# Altium schematic sheet TOP_LEVEL.SchDoc
size A4; DocumentNumber: 2; SheetNumber: 2; SheetTotal: 9
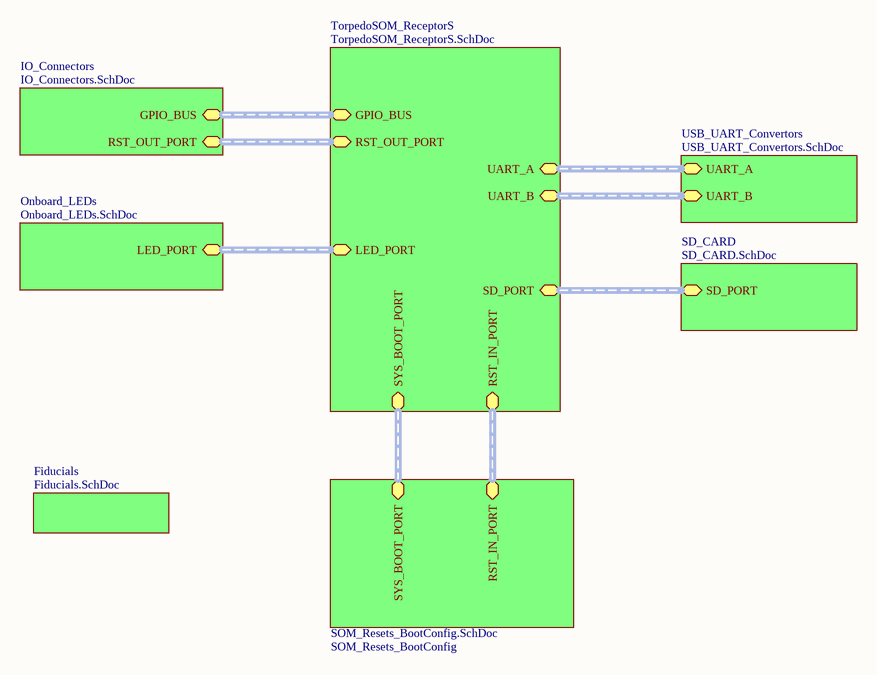
[diagram p0: TOP_LEVEL.SchDoc]

## Sub-sheets
Fiducials = Fiducials.SchDoc: no entries
IO_Connectors = IO_Connectors.SchDoc: GPIO_BUS (harness GPIO), RST_OUT_PORT (harness RST_OUT_BUS)
Onboard_LEDs = Onboard_LEDs.SchDoc: LED_PORT (harness LED_BUS)
SD_CARD = SD_CARD.SchDoc: SD_PORT (harness SD_BUS)
SOM_Resets_BootConfig = SOM_Resets_BootConfig.SchDoc: SYS_BOOT_PORT (harness SYS_BOOT_BUS), RST_IN_PORT (harness RST_IN_BUS)
TorpedoSOM_ReceptorS = TorpedoSOM_ReceptorS.SchDoc: UART_A (harness UART), GPIO_BUS (harness GPIO), UART_B (harness UART), SD_PORT (harness SD_BUS), SYS_BOOT_PORT (harness SYS_BOOT_BUS), RST_IN_PORT (harness RST_IN_BUS), LED_PORT (harness LED_BUS), RST_OUT_PORT (harness RST_OUT_BUS)
USB_UART_Convertors = USB_UART_Convertors.SchDoc: UART_A (harness UART), UART_B (harness UART)

## Buses and harness runs
harness sheet IO_Connectors/GPIO_BUS = sheet TorpedoSOM_ReceptorS/GPIO_BUS
harness sheet IO_Connectors/RST_OUT_PORT = sheet TorpedoSOM_ReceptorS/RST_OUT_PORT
harness sheet Onboard_LEDs/LED_PORT = sheet TorpedoSOM_ReceptorS/LED_PORT
harness sheet SD_CARD/SD_PORT = sheet TorpedoSOM_ReceptorS/SD_PORT
harness sheet SOM_Resets_BootConfig/RST_IN_PORT = sheet TorpedoSOM_ReceptorS/RST_IN_PORT
harness sheet SOM_Resets_BootConfig/SYS_BOOT_PORT = sheet TorpedoSOM_ReceptorS/SYS_BOOT_PORT
harness sheet TorpedoSOM_ReceptorS/UART_A = sheet USB_UART_Convertors/UART_A
harness sheet TorpedoSOM_ReceptorS/UART_B = sheet USB_UART_Convertors/UART_B